# Altium schematic sheet 驱动第一板.SchDoc
size A4
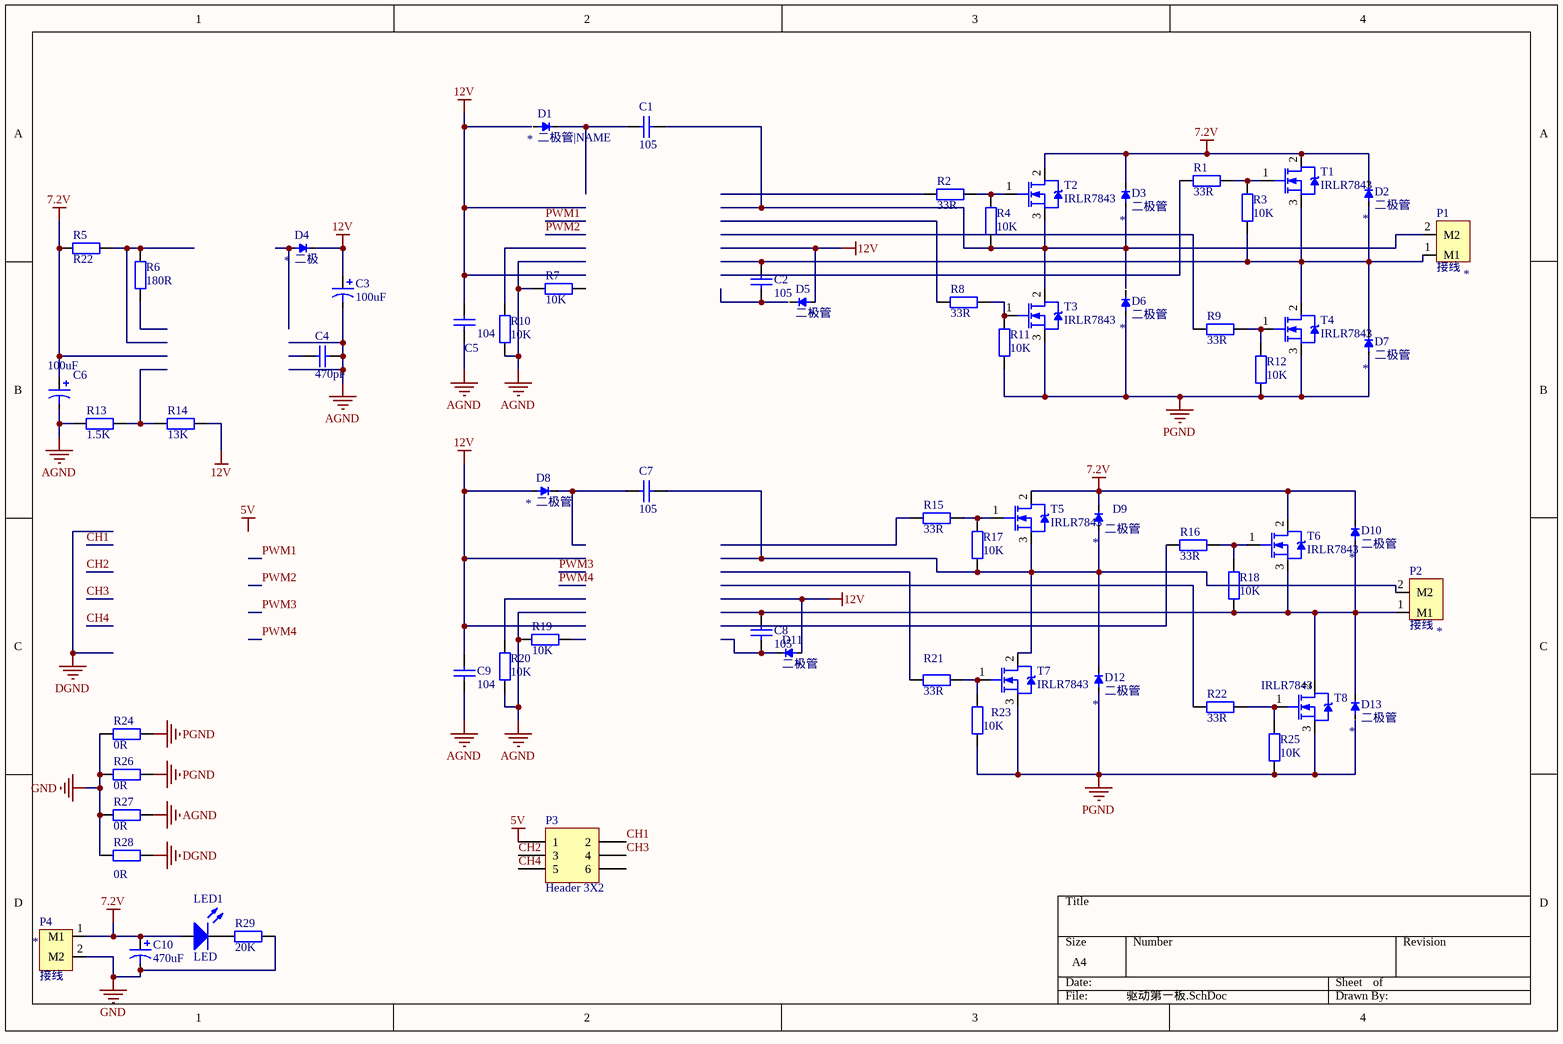
[diagram p0: 驱动第一板.SchDoc]

## Parts
C1  105  [0805]
C2  105  [0805]
C3  100uF  [ED6.3]
C4  470pF  [0603]
C5  104  [0805]
C6  100uF  [Pol Cap(220uF)]
C7  105  [0805]
C8  105  [0805]
C9  104  [0805]
C10  470uF  [ED8]
D1  *  [二极管]
D2  *  [二极管]
D3  *  [二极管]
D4  *  [二极管]
D5  *  [二极管]
D6  *  [二极管]
D7  *  [二极管]
D8  *  [二极管]
D9  *  [二极管]
D10  *  [二极管]
D11  *  [二极管]
D12  *  [二极管]
D13  *  [二极管]
LED1  LED  [LED(0805)]
P1  *  [接线端子]
P2  *  [接线端子]
P3  Header 3X2  [HDR2X3]
P4  *  [接线端子]
R1  33R  [0603]
R2  33R  [0603]
R3  10K  [0603]
R4  10K  [0603]
R5  R22  [0603]
R6  180R  [0603]
R7  10K  [0603]
R8  33R  [0603]
R9  33R  [0603]
R10  10K  [0603]
R11  10K  [0603]
R12  10K  [0603]
R13  1.5K  [0603]
R14  13K  [0603]
R15  33R  [0603]
R16  33R  [0603]
R17  10K  [0603]
R18  10K  [0603]
R19  10K  [0603]
R20  10K  [0603]
R21  33R  [0603]
R22  33R  [0603]
R23  10K  [0603]
R24  0R  [0805]
R25  10K  [0603]
R26  0R  [0805]
R27  0R  [0805]
R28  0R  [0805]
R29  20K  [0603]
T1  IRLR7843  [IRLR7843(MOS)]
T2  IRLR7843  [IRLR7843(MOS)]
T3  IRLR7843  [IRLR7843(MOS)]
T4  IRLR7843  [IRLR7843(MOS)]
T5  IRLR7843  [IRLR7843(MOS)]
T6  IRLR7843  [IRLR7843(MOS)]
T7  IRLR7843  [IRLR7843(MOS)]
T8  IRLR7843  [IRLR7843(MOS)]

## Nets
5V: P3.1
7.2V: C6.1 C10.1 D2.2(-) D3.2(-) D9.2(-) D10.2(-) LED1.1(A) P4.1(M1) R5.1 T1.2(D) T2.2(D) T5.2(D) T6.2(D)
12V: C3.1 C5.2 C9.2 D4.2(-) D5.1(+) D8.1(+) D11.1(+) R14.2
AGND: C3.2 C4.2 C5.1 C6.2 C9.1 R7.1 R10.1 R13.1 R19.2 R20.1 R27.2
DGND: R28.2
GND: C10.2 P4.2(M2) R24.1 R26.1 R27.1 R28.1 R29.2
PGND: D6.1(+) D7.1(+) D12.1(+) R11.1 R12.2 R23.1 R24.2 R25.1 R26.2 T3.3(S) T4.3(S) T7.3(S) T8.3(S)
CH1: P3.2
CH2: P3.3
CH3: P3.4
CH4: P3.5
NetC1_1: C1.1 D1.2(-)
NetC1_2: C1.2 D3.1(+) P1.2(M2) R4.1 T2.3(S) T3.2(D)
NetC2_2: C2.2 D2.1(+) D7.2(-) P1.1(M1) R3.1 T1.3(S) T4.2(D)
NetC7_1: C7.1 D8.2(-)
NetC7_2: C7.2 D9.1(+) D12.2(-) P2.2(M2) R17.1 T5.3(S) T7.2(D)
NetC8_1: C8.1 D11.2(-)
NetC8_2: C8.2 D10.1(+) D13.2(-) P2.1(M1) R18.1 T6.3(S) T8.2(D)
NetLED1_2: LED1.2(K) R29.1
NetR1_1: R1.1 R3.2 T1.1(G)
NetR2_2: R2.2 R4.2 T2.1(G)
NetR5_2: R5.2 R6.2
NetR8_2: R8.2 R11.2 T3.1(G)
NetR9_1: R9.1 R12.1 T4.1(G)
NetR13_2: R13.2 R14.1
NetR15_2: R15.2 R17.2 T5.1(G)
NetR16_2: R16.2 R18.2 T6.1(G)
NetR21_2: R21.2 R23.2 T7.1(G)
NetR22_2: R22.2 R25.2 T8.1(G)

Not connected (* = marked no-connect by the designer): C2 1; C4 1; D1 1(+); D4 1(+); D5 2(-); D6 2(-); D13 1(+); P3 6; R1 2; R2 1; R6 1; R7 2; R8 1; R9 2; R10 2; R15 1; R16 1; R19 1; R20 2; R21 1; R22 1

## Notes on the sheet
- Labels drawn without touching a wire or pin: 5V
- (in symbol 二极管) 二极; 二极管|NAME
- (in symbol 接线端子) 接线

## Library data of the parts
C1 C2 C4 C5 C7-C9 = Cap: 无极电容; Value: 10uF
C3 C10 = 固态贴片电容: ED8:470UF  ED6.3:100UF
C6 = pol cap: 通用有极电容; value: 22uF
D1-D13 = 二极管
  D2 D3 D5-D13: C: 二极管
LED1 = LED: 发光二极管
P1 P2 P4 = 接线端子
P3 = Header 3X2: Header, 3-Pin, Dual row; LatestRevisionDate: 17-Jul-2002; LatestRevisionNote: Re-released for DXP Platform.; Publisher: Altium Limited
R1 R2 R5 R6 R8 R9 R13-R16 R21 R22 R24 R26-R29 = Res: 通用电阻; Value: 10K
R3 R4 R7 R10-R12 R17-R20 R23 R25 = Res: 通用电阻; Value: 10K
T1-T8 = N_MOS(IRLR7